# Altium schematic sheet 3-H桥驱动.SchDoc
size A4; SheetNumber: 4; SheetTotal: 4
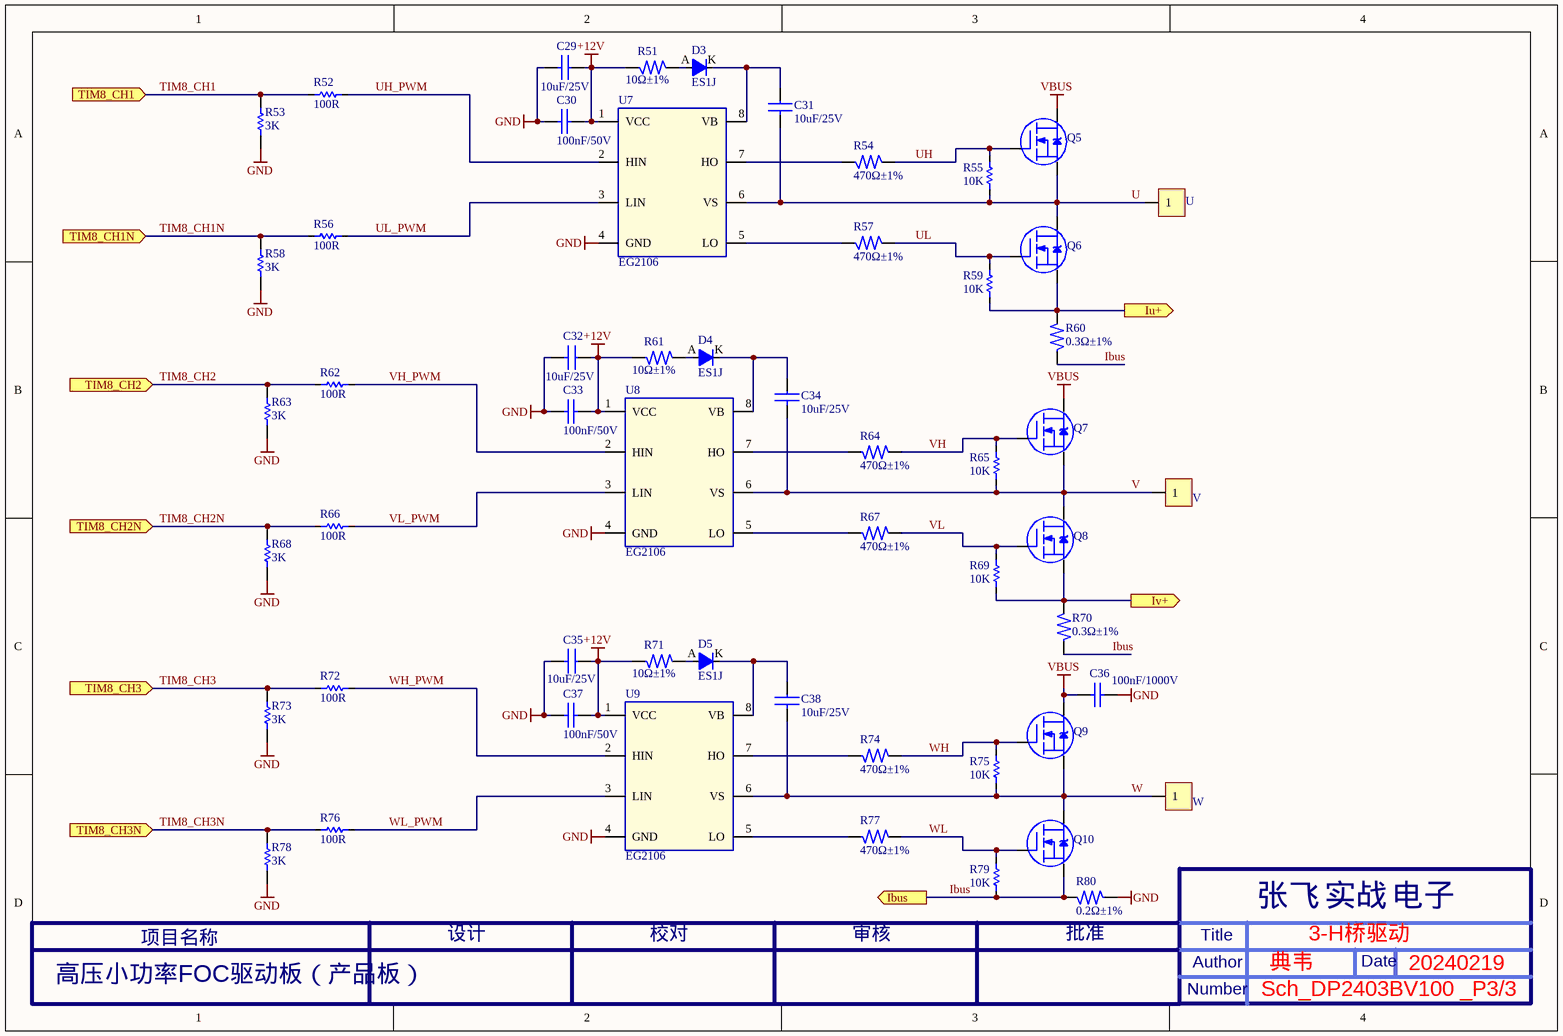
[diagram p0: 3-H桥驱动.SchDoc]

## Parts
C29  10uF/25V  [C0805]
C30  100nF/50V  [C0603]
C31  10uF/25V  [C0805]
C32  10uF/25V  [C0805]
C33  100nF/50V  [C0603]
C34  10uF/25V  [C0805]
C35  10uF/25V  [C0805]
C36  100nF/1000V  [C1812]
C37  100nF/50V  [C0603]
C38  10uF/25V  [C0805]
D3  ES1J  [DO-214AC(SMA)]
D4  ES1J  [DO-214AC(SMA)]
D5  ES1J  [DO-214AC(SMA)]
Q5  MOT5N50D  [TO-252AA]  (value not drawn)
Q6  MOT5N50D  [TO-252AA]  (value not drawn)
Q7  MOT5N50D  [TO-252AA]  (value not drawn)
Q8  MOT5N50D  [TO-252AA]  (value not drawn)
Q9  MOT5N50D  [TO-252AA]  (value not drawn)
Q10  MOT5N50D  [TO-252AA]  (value not drawn)
R51  10Ω±1%  [R0805]
R52  100R  [R0603]
R53  3K  [R0603]
R54  470Ω±1%  [R0603]
R55  10K  [R0603]
R56  100R  [R0603]
R57  470Ω±1%  [R0603]
R58  3K  [R0603]
R59  10K  [R0603]
R60  0.3Ω±1%  [R1206]
R61  10Ω±1%  [R0805]
R62  100R  [R0603]
R63  3K  [R0603]
R64  470Ω±1%  [R0603]
R65  10K  [R0603]
R66  100R  [R0603]
R67  470Ω±1%  [R0603]
R68  3K  [R0603]
R69  10K  [R0603]
R70  0.3Ω±1%  [R1206]
R71  10Ω±1%  [R0805]
R72  100R  [R0603]
R73  3K  [R0603]
R74  470Ω±1%  [R0603]
R75  10K  [R0603]
R76  100R  [R0603]
R77  470Ω±1%  [R0603]
R78  3K  [R0603]
R79  10K  [R0603]
R80  0.2Ω±1%  [R1206]
U  U  [IGBT-PIN]  (value not drawn)
U7  EG2106  [SOIC-8]
U8  EG2106  [SOIC-8]
U9  EG2106  [SOIC-8]
V  V  [IGBT-PIN]  (value not drawn)
W  W  [IGBT-PIN]  (value not drawn)

## Ports
Ibus (out, see 0-模块总图[3B]), Iu+ (out, see 0-模块总图[3B]), Iv+ (out, see 0-模块总图[3B]), TIM8_CH1 (in, see 0-模块总图[3B]), TIM8_CH1N (in, see 0-模块总图[3B]), TIM8_CH2 (in, see 0-模块总图[3B]), TIM8_CH2N (in, see 0-模块总图[3B]), TIM8_CH3 (in, see 0-模块总图[3B]), TIM8_CH3N (in, see 0-模块总图[3B])

## Nets
+12V: C29.1 C30.2 C32.1 C33.2 C35.1 C37.2 R51.1 R61.1 R71.1 U7.1(VCC) U8.1(VCC) U9.1(VCC)
GND: C29.2 C30.1 C32.2 C33.1 C35.2 C36.2 C37.1 R53.2 R58.2 R63.2 R68.2 R73.2 R78.2 R80.1 U7.4(GND) U8.4(GND) U9.4(GND)
VBUS: C36.1 Q5.D Q7.D Q9.D
Ibus: Q10.S R60.1 R70.1 R79.2 R80.2 ; port Ibus
Iu+: Q6.S R59.2 R60.2 ; port Iu+
Iv+: Q8.S R69.2 R70.2 ; port Iv+
TIM8_CH1: R52.1 R53.1 ; port TIM8_CH1
TIM8_CH1N: R56.1 R58.1 ; port TIM8_CH1N
TIM8_CH2: R62.1 R63.1 ; port TIM8_CH2
TIM8_CH2N: R66.1 R68.1 ; port TIM8_CH2N
TIM8_CH3: R72.1 R73.1 ; port TIM8_CH3
TIM8_CH3N: R76.1 R78.1 ; port TIM8_CH3N
U: C31.2 Q5.S Q6.D R55.2 U.1 U7.6(VS)
UH: Q5.G R54.2 R55.1
UH_PWM: R52.2 U7.2(HIN)
UL: Q6.G R57.2 R59.1
UL_PWM: R56.2 U7.3(LIN)
V: C34.2 Q7.S Q8.D R65.2 U8.6(VS) V.1
VH: Q7.G R64.2 R65.1
VH_PWM: R62.2 U8.2(HIN)
VL: Q8.G R67.2 R69.1
VL_PWM: R66.2 U8.3(LIN)
W: C38.2 Q9.S Q10.D R75.2 U9.6(VS) W.1
WH: Q9.G R74.2 R75.1
WH_PWM: R72.2 U9.2(HIN)
WL: Q10.G R77.2 R79.1
WL_PWM: R76.2 U9.3(LIN)
NetC31_1: C31.1 D3.K U7.8(VB)
NetC34_1: C34.1 D4.K U8.8(VB)
NetC38_1: C38.1 D5.K U9.8(VB)
NetD3_A: D3.A R51.2
NetD4_A: D4.A R61.2
NetD5_A: D5.A R71.2
NetR54_1: R54.1 U7.7(HO)
NetR57_1: R57.1 U7.5(LO)
NetR64_1: R64.1 U8.7(HO)
NetR67_1: R67.1 U8.5(LO)
NetR74_1: R74.1 U9.7(HO)
NetR77_1: R77.1 U9.5(LO)

## Notes on the sheet
- 高压小功率FOC驱动板（产品板）
- 典韦
- 3-H桥驱动
- 20240219
- Sch_DP2403BV100 _P3/3
- 张飞
- 实战
- 电子
- 项目名称
- 设计
- 校对
- 审核
- 批准
- Author
- Title
- Date
- Number

## Library data of the parts
C29 C31 C32 C34 C35 C38 = CAP NP_0: 贴片电容; Manufacturer: TDK; Dielectric: <Dielectric>; Voltage: <Voltage>; RK PN: C1005X5R0J104K050BA; Priority: A; parameter: <parameter>; Manufacturer PN: C1005X5R0J104K050BA; Created by: JJJ
C30 C33 C36 C37 = CAP: 贴片电容
D3-D5 = DIO: 二极管; 品牌: IN4007; Part Number: *; 供应商物料号: *; 规格型号: *
R51 R54 R57 R60 R61 R64 R67 R70 R71 R74 R77 R80 = RES: 名称: 贴片电阻
R52 R53 R55 R56 R58 R59 R62 R63 R65 R66 R68 R69 R72 R73 R75 R76 R78 R79 = Res: 电阻; Manufacturer: Generic Components; Class: Passive; SubClass: Resistor; Value: 0.125W; Published: 08/06/2000; Publisher: Altium Hobart Technology Centre; Package: 0805
U V W = Pin1: 1Pin
U7-U9 = EG2106: 名称: 贴片IC
Q5-Q10 = MOT5N50D: Supplier-1: IR